# EAGLE design A203-V2-Expansion-Board (EAGLE 9.6.2)
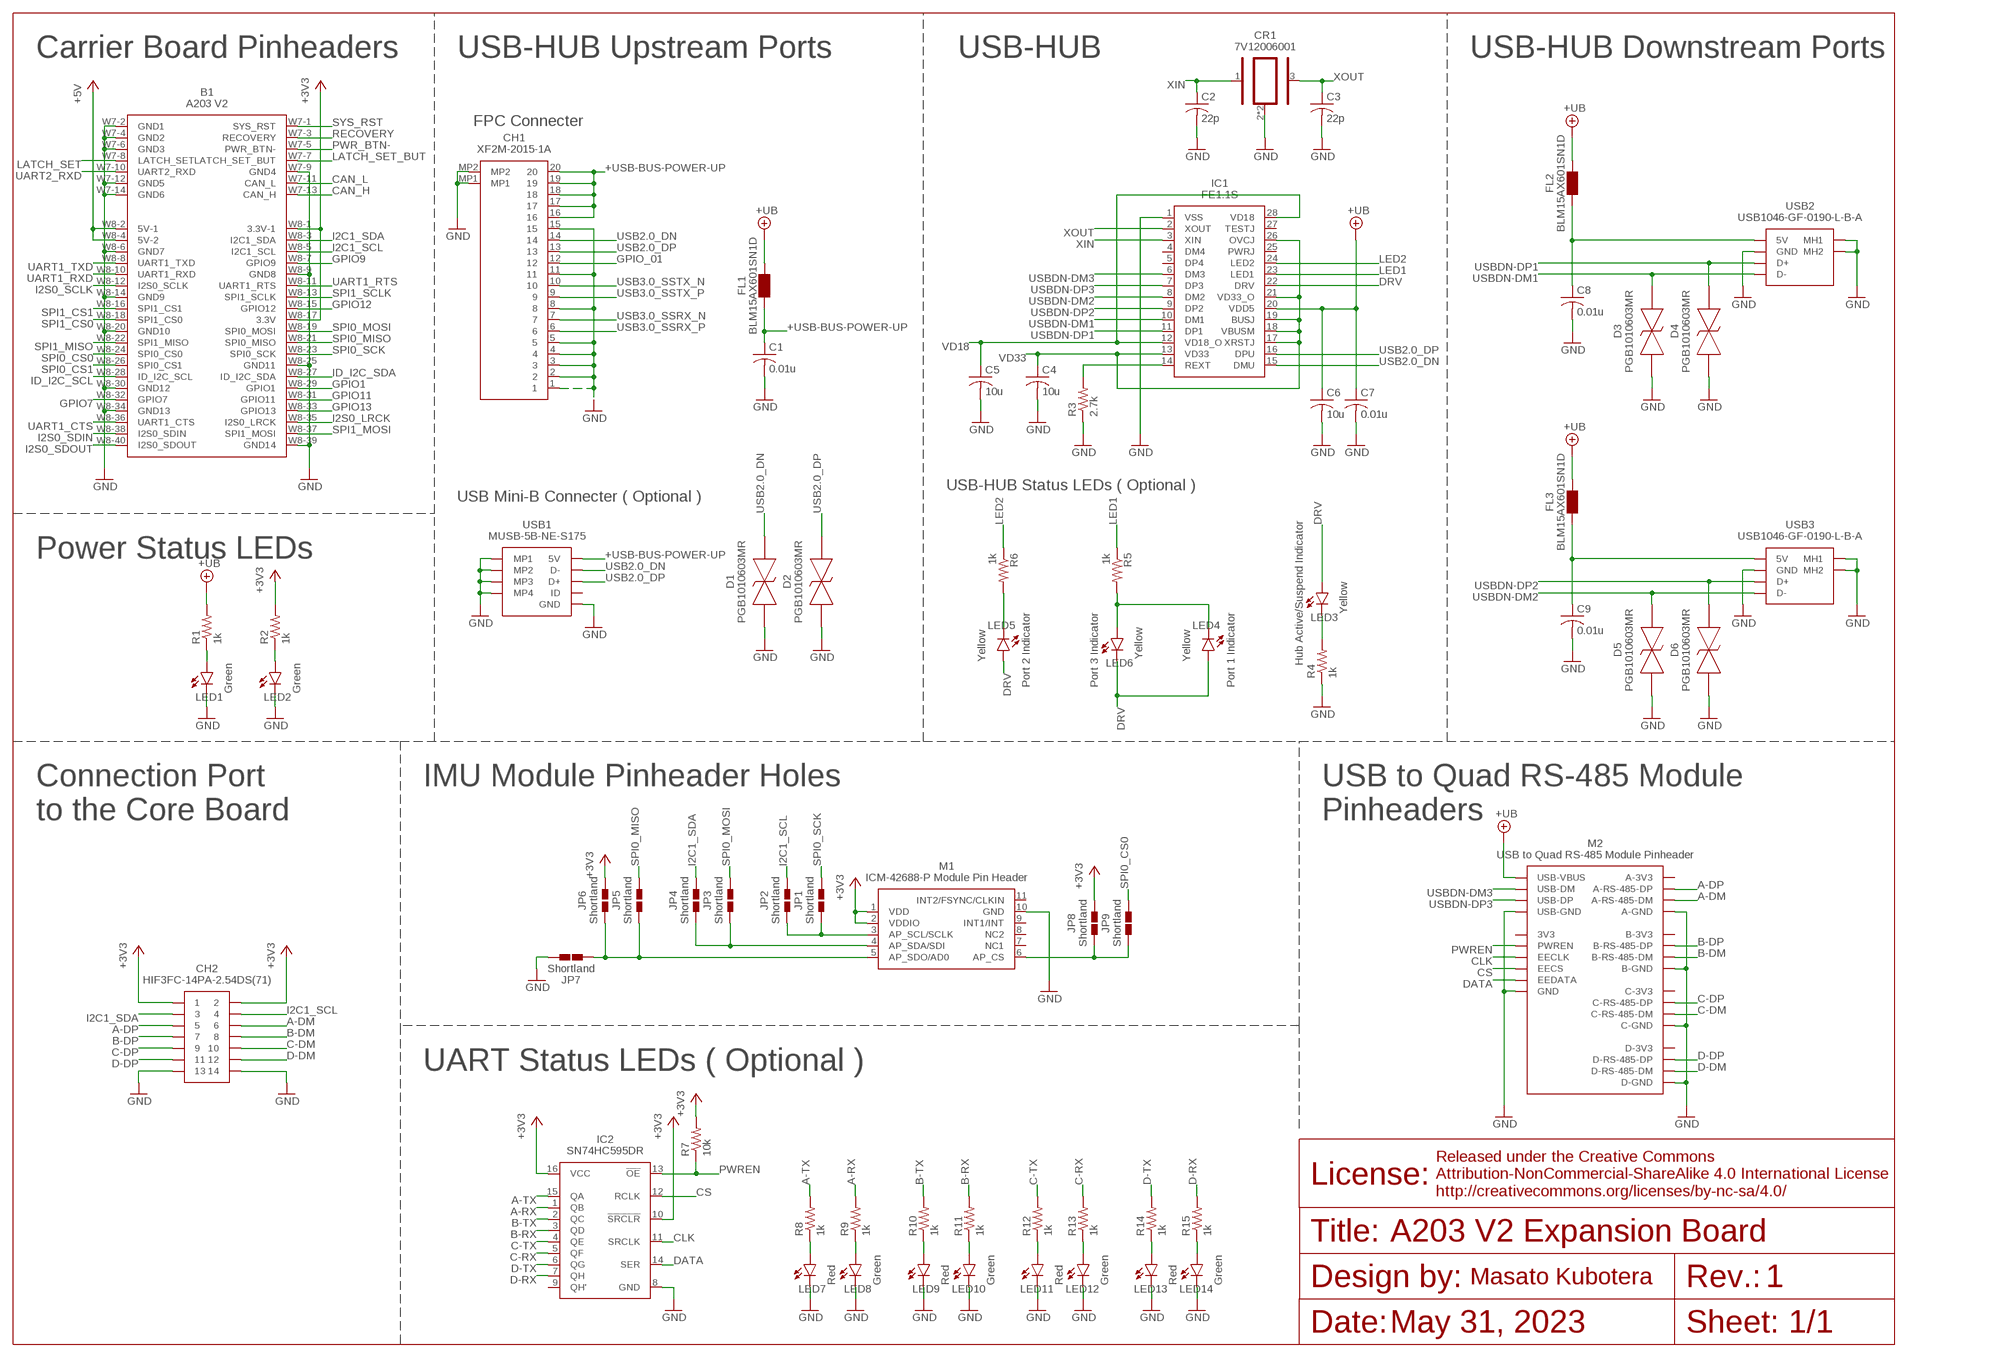
[diagram p0: schematic, sheet 1]

## Parts
B1  SEEED_A207_V2  [SEEED_A203_V2]
C1  0.01u  C-USC0603  [C0603]
C2  22p  C-USC0603  [C0603]
C3  22p  C-USC0603  [C0603]
C4  10u  C-USC0603  [C0603]
C5  10u  C-USC0603  [C0603]
C6  10u  C-USC0603  [C0603]
C7  0.01u  C-USC0603  [C0603]
C8  0.01u  C-USC0603  [C0603]
C9  0.01u  C-USC0603  [C0603]
CH1  XF2M-2015-1A  [XF2M-2015-1A]
CH2  HIF3FC-14PA-2.54DS(71)  [HIF3FC-14PA-2.54DS(71)]
CR1  7V12006001  [7V12006001]
D1  PGB1010603MR  [0603]
D2  PGB1010603MR  [0603]
D3  PGB1010603MR  [0603]
D4  PGB1010603MR  [0603]
D5  PGB1010603MR  [0603]
D6  PGB1010603MR  [0603]
FL1  BLM15AX601SN1D  [BLM15AX601SN1D]
FL2  BLM15AX601SN1D  [BLM15AX601SN1D]
FL3  BLM15AX601SN1D  [BLM15AX601SN1D]
IC1  FE1.1S  [FE1.1S]
IC2  SN74HC595DR  [SOIC-16]
JP1  SHORTLAND  [SHORTLAND]
JP2  SHORTLAND  [SHORTLAND]
JP3  SHORTLAND  [SHORTLAND]
JP4  SHORTLAND  [SHORTLAND]
JP5  SHORTLAND  [SHORTLAND]
JP6  SHORTLAND  [SHORTLAND]
JP7  SHORTLAND  [SHORTLAND]
JP8  SHORTLAND  [SHORTLAND]
JP9  SHORTLAND  [SHORTLAND]
LED1  Green  LEDSML0603  [SML0603]
LED2  Green  LEDSML0603  [SML0603]
LED3  Yellow  LEDSML0603  [SML0603]
LED4  Yellow  LEDSML0603  [SML0603]
LED5  Yellow  LEDSML0603  [SML0603]
LED6  Yellow  LEDSML0603  [SML0603]
LED7  Red  LEDSML0603  [SML0603]
LED8  Green  LEDSML0603  [SML0603]
LED9  Red  LEDSML0603  [SML0603]
LED10  Green  LEDSML0603  [SML0603]
LED11  Red  LEDSML0603  [SML0603]
LED12  Green  LEDSML0603  [SML0603]
LED13  Red  LEDSML0603  [SML0603]
LED14  Green  LEDSML0603  [SML0603]
M1  ICM-42688-P-MODULE-PINHEADER  [ICM-42688-P-MODULE-PINHEADER]
M2  USB-TO-QUAD-RS-485-CONV-MODULET-PLACE  [USB-TO-QUAD-RS-485-CONV-MODULE-SILK]
R1  1k  R-US_R0603  [R0603]
R2  1k  R-US_R0603  [R0603]
R3  2.7k  R-US_R0603  [R0603]
R4  1k  R-US_R0603  [R0603]
R5  1k  R-US_R0603  [R0603]
R6  1k  R-US_R0603  [R0603]
R7  10k  R-US_R0603  [R0603]
R8  1k  R-US_R0603  [R0603]
R9  1k  R-US_R0603  [R0603]
R10  1k  R-US_R0603  [R0603]
R11  1k  R-US_R0603  [R0603]
R12  1k  R-US_R0603  [R0603]
R13  1k  R-US_R0603  [R0603]
R14  1k  R-US_R0603  [R0603]
R15  1k  R-US_R0603  [R0603]
USB1  MINI_USB_B_SMD  [MINI_USB_B_SMD]
USB2  USB_A_X1_SMD  [USB_A_X1_SMD]
USB3  USB_A_X1_SMD  [USB_A_X1_SMD]

## Nets
+3V3 [low-power]: B1.W8-1(3.3V-1) B1.W8-17(3.3V) CH2.1 CH2.2 IC2.10(!SRCLR) IC2.16(VCC) JP6.2 JP8.2 M1.1(VDD) M1.2(VDDIO) R2.2 R7.2
+5V [low-power]: B1.W8-2(5V-1) B1.W8-4(5V-2)
+UB [usb-power]: C6.1 C7.1 FL1.2 FL2.2 FL3.2 IC1.20(VDD5) M2.USB-VBUS R1.2
+USB-BUS-POWER-UP [usb-power]: C1.1 CH1.16 CH1.17 CH1.18 CH1.19 CH1.20 FL1.1 USB1.1(5V)
+USB-BUS-POWER_DN1 [usb-power]: C8.1 FL2.1 USB2.1(5V)
+USB-BUS-POWER_DN2 [usb-power]: C9.1 FL3.1 USB3.1(5V)
A-DM: CH2.6 M2.A-RS-485-DM
A-DP: CH2.5 M2.A-RS-485-DP
A-RX: IC2.1(QB) R9.2
A-TX: IC2.15(QA) R8.2
AP_CS: JP8.1 JP9.1 M1.6(AP_CS)
AP_SCL/SCLK: JP1.1 JP2.1 M1.3(AP_SCL/SCLK)
AP_SDA/SDI: JP3.1 JP4.1 M1.4(AP_SDA/SDI)
AP_SDO/ADO: JP5.1 JP6.1 JP7.1 M1.5(AP_SDO/AD0)
B-DM: CH2.8 M2.B-RS-485-DM
B-DP: CH2.7 M2.B-RS-485-DP
B-RX: IC2.3(QD) R11.2
B-TX: IC2.2(QC) R10.2
C-DM: CH2.10 M2.C-RS-485-DM
C-DP: CH2.9 M2.C-RS-485-DP
C-RX: IC2.5(QF) R13.2
C-TX: IC2.4(QE) R12.2
CAN_H: B1.W7-13(CAN_H)
CAN_L: B1.W7-11(CAN_L)
CLK: IC2.11(SRCLK) M2.EECLK
CS: IC2.12(RCLK) M2.EECS
D-DM: CH2.12 M2.D-RS-485-DM
D-DP: CH2.11 M2.D-RS-485-DP
D-RX: IC2.7(QH) R15.2
D-TX: IC2.6(QG) R14.2
DATA: IC2.14(SER) M2.EEDATA
DRV: IC1.22(DRV) LED3.A LED4.A LED5.A LED6.C
GND: B1.W7-2(GND1) B1.W7-4(GND2) B1.W7-6(GND3) B1.W7-9(GND4) B1.W7-12(GND5) B1.W7-14(GND6) B1.W8-6(GND7) B1.W8-9(GND8) B1.W8-14(GND9) B1.W8-20(GND10) B1.W8-25(GND11) B1.W8-30(GND12) B1.W8-34(GND13) B1.W8-39(GND14) C1.2 C2.2 C3.2 C4.2 C5.2 C6.2 C7.2 C8.2 C9.2 CH1.1 CH1.2 CH1.3 CH1.4 CH1.5 CH1.8 CH1.11 CH1.15 CH1.MP1 CH1.MP2 CH2.13 CH2.14 CR1.2 CR1.4 D1.1 D2.1 D3.1 D4.1 D5.1 D6.1 IC1.1(VSS) IC2.8(GND) JP7.2 LED1.C LED2.C LED7.C LED8.C LED9.C LED10.C LED11.C LED12.C LED13.C LED14.C M1.10(GND) M2.A-GND M2.B-GND M2.C-GND M2.D-GND M2.GND1(GND) M2.USB-GND R3.1 R4.1 USB1.5(GND) USB1.MP1 USB1.MP2 USB1.MP3 USB1.MP4 USB2.4(GND) USB2.MH1 USB2.MH2 USB3.4(GND) USB3.MH1 USB3.MH2
GPIO1: B1.W8-29(GPIO1)
GPIO7: B1.W8-32(GPIO7)
GPIO9: B1.W8-7(GPIO9)
GPIO11: B1.W8-31(GPIO11)
GPIO12: B1.W8-15(GPIO12)
GPIO13: B1.W8-33(GPIO13)
GPIO_01: CH1.12
I2C1_SCL: B1.W8-5(I2C1_SCL) CH2.4 JP2.2
I2C1_SDA: B1.W8-3(I2C1_SDA) CH2.3 JP4.2
I2S0_LRCK: B1.W8-35(I2S0_LRCK)
I2S0_SCLK: B1.W8-12(I2S0_SCLK)
I2S0_SDIN: B1.W8-38(I2S0_SDIN)
I2S0_SDOUT: B1.W8-40(I2S0_SDOUT)
ID_I2C_SCL: B1.W8-28(ID_I2C_SCL)
ID_I2C_SDA: B1.W8-27(ID_I2C_SDA)
LATCH_SET: B1.W7-8(LATCH_SET)
LATCH_SET_BUT: B1.W7-7(LATCH_SET_BUT)
LED1 [low-power]: IC1.23(LED1) R5.1
LED2 [low-power]: IC1.24(LED2) R6.1
LED-3V3 [low-power]: LED2.A R2.1
LED-A-RX [low-power]: LED8.A R9.1
LED-A-TX [low-power]: LED7.A R8.1
LED-B-RX [low-power]: LED10.A R11.1
LED-B-TX [low-power]: LED9.A R10.1
LED-C-RX [low-power]: LED12.A R13.1
LED-C-TX [low-power]: LED11.A R12.1
LED-D-RX [low-power]: LED14.A R15.1
LED-D-TX [low-power]: LED13.A R14.1
LED-FE1.1S-DRV [low-power]: LED3.C R4.2
LED-FE1.1S-INDIVATOR1 [low-power]: LED4.C LED6.A R5.2
LED-FE1.1S-INDIVATOR2 [low-power]: LED5.C R6.2
LED-UB [low-power]: LED1.A R1.1
PWR_BTN-: B1.W7-5(PWR_BTN-)
PWREN: IC2.13(!OE) M2.PWREN R7.1
RECOVERY: B1.W7-3(RECOVERY)
REXT_FE1.1S: IC1.14(REXT) R3.2
SPI0_CS0: B1.W8-24(SPI0_CS0) JP9.2
SPI0_CS1: B1.W8-26(SPI0_CS1)
SPI0_MISO: B1.W8-21(SPI0_MISO) JP5.2
SPI0_MOSI: B1.W8-19(SPI0_MOSI) JP3.2
SPI0_SCK: B1.W8-23(SPI0_SCK) JP1.2
SPI1_CS0: B1.W8-18(SPI1_CS0)
SPI1_CS1: B1.W8-16(SPI1_CS1)
SPI1_MISO: B1.W8-22(SPI1_MISO)
SPI1_MOSI: B1.W8-37(SPI1_MOSI)
SPI1_SCLK: B1.W8-13(SPI1_SCLK)
SYS_RST: B1.W7-1(SYS_RST)
UART1_CTS: B1.W8-36(UART1_CTS)
UART1_RTS: B1.W8-11(UART1_RTS)
UART1_RXD: B1.W8-10(UART1_RXD)
UART1_TXD: B1.W8-8(UART1_TXD)
UART2_RXD: B1.W7-10(UART2_RXD)
USB2.0_DN: CH1.14 D1.2 IC1.15(DMU) USB1.2(D-)
USB2.0_DP: CH1.13 D2.2 IC1.16(DPU) USB1.3(D+)
USB3.0_SSRX_N: CH1.7
USB3.0_SSRX_P: CH1.6
USB3.0_SSTX_N: CH1.10
USB3.0_SSTX_P: CH1.9
USBDN-DM1: D3.2 IC1.10(DM1) USB2.2(D-)
USBDN-DM2: D5.2 IC1.8(DM2) USB3.2(D-)
USBDN-DM3: IC1.6(DM3) M2.USB-DM
USBDN-DP1: D4.2 IC1.11(DP1) USB2.3(D+)
USBDN-DP2: D6.2 IC1.9(DP2) USB3.3(D+)
USBDN-DP3: IC1.7(DP3) M2.USB-DP
VD18: C5.1 IC1.12(VD18_O) IC1.28(VD18)
VD33: C4.1 IC1.13(VD33) IC1.17(XRSTJ) IC1.18(VBUSM) IC1.19(BUSJ) IC1.21(VD33_O) IC1.26(OVCJ)
XIN: C2.1 CR1.1 IC1.3(XIN)
XOUT: C3.1 CR1.3 IC1.2(XOUT)
Unconnected: IC1.4(DM4) IC1.5(DP4) IC1.25(PWRJ) IC1.27(TESTJ) IC2.9(QH') M1.7(NC1) M1.8(NC2) M1.9(INT1/INT) M1.11(INT2/FSYNC/CLKIN) M2.3V3 M2.A-3V3 M2.B-3.3V(B-3V3) M2.C-3V3 M2.D-3V3 USB1.4(ID)

## Notes on the sheet
- Carrier Board Pinheaders | USB-HUB Upstream Ports | USB-HUB | USB-HUB Downstream Ports
- FPC Connecter
- USB-HUB Status LEDs ( Optional )
- USB Mini-B Connecter ( Optional )
- Power Status LEDs
- Hub Active/Suspend Indicator
- Port 2 Indicator | Port 3 Indicator | Port 1 Indicator
- Connection Port
  to the Core Board
- IMU Module Pinheader Holes
- USB to Quad RS-485 Module
  Pinheaders
- UART Status LEDs ( Optional )
- A203 V2 Expansion Board
- 1
- May 31, 2023 | 1/1

## Library data of the parts
B1 = Seeed_A203_V2:SEEED_A207_V2
C1-C9 = rcl:C-US: CAPACITOR, American symbol; SPICEPREFIX: C
CH1 = XF2M-2015-1A:XF2M-2015-1A
CH2 = HIF3FC:HIF3FC-14PA-2.54DS(71)
CR1 = 7V12006001:7V12006001
D1-D6 = PGB1010603MR:PGB1010603MR
FL1-FL3 = BLM15AX601SN1D:BLM15AX601SN1D
IC1 = FE1.1S:FE1.1S
IC2 = SN74HC595DR:SN74HC595DR
JP1-JP9 = Shortland:SHORTLAND
LED1-LED14 = led:LED: LED OSRAM: - CHIPLED LG R971, LG N971, LY N971, LG Q971, LY Q971, LO R971, LY R971 LH N974, LH R974 LS Q976, LO Q976, LY Q976 LO Q996 - Hyper CHIPLED LW Q18S LB Q993, LB Q99A, LB R99A - SideLED LS A670, LO A670, LY A670, LG A670, LP A670 LB A673, LV A673, LT A673, LW A673 LH A674 LY A675 LS A676, LA A676, LO A676, LY A676, LW A676 LS A679, LY A679, LG A679 - Hyper Micro SIDELED® LS Y876, LA Y876, LO Y876, LY Y876 LT Y87S - SmartLED LW L88C, LW L88S LB L89C, LB L89S, LG L890 LS L89K, LO L89K, LY L89K LS L896, LA L896, LO L896, LY L896 - TOPLED LS T670, LO T670, LY T670, LG T670, LP T670 LSG T670, LSP T670, LSY T670, LOP T670, LYG T670 LG T671, LOG T671, LSG T671 LB T673, LV T673, LT T673, LW T673 LH T674 LS T676, LA T676, LO T676, LY T676, LB T676, LH T676, LSB T676, LW T676 LB T67C, LV T67C, LT T67C, LS T67K, LO T67K, LY T67K, LW E67C LS E67B, LA E67B, LO E67B, LY E67B, LB E67C, LV E67C, LT E67C LW T67C LS T679, LY T679, LG T679 LS T770, LO T770, LY T770, LG T770, LP T770 LB T773, LV T773, LT T773, LW T773 LH T774 LS E675, LA E675, LY E675, LS T675 LS T776, LA T776, LO T776, LY T776, LB T776 LHGB T686 LT T68C, LB T68C - Hyper Mini TOPLED® LB M676 - Mini TOPLED Santana® LG M470 LS M47K, LO M47K, LY M47K Source: http://www.osram.convergy.de LUXEON: - LUMILED® LXK2-PW12-R00, LXK2-PW12-S00, LXK2-PW14-U00, LXK2-PW14-V00 LXK2-PM12-R00, LXK2-PM12-S00, LXK2-PM14-U00 LXK2-PE12-Q00, LXK2-PE12-R00, LXK2-PE12-S00, LXK2-PE14-T00, LXK2-PE14-U00 LXK2-PB12-K00, LXK2-PB12-L00, LXK2-PB12-M00, LXK2-PB14-N00, LXK2-PB14-P00, LXK2-PB14-Q00 LXK2-PR12-L00, LXK2-PR12-M00, LXK2-PR14-Q00, LXK2-PR14-R00 LXK2-PD12-Q00, LXK2-PD12-R00, LXK2-PD12-S00 LXK2-PH12-R00, LXK2-PH12-S00 LXK2-PL12-P00, LXK2-PL12-Q00, LXK2-PL12-R00 Source: www.luxeon.com KINGBRIGHT: KA-3528ASYC Source: www.kingbright.com
M1 = ICM-42688-P-Module:ICM-42688-P-MODULE-PINHEADER
M2 = USB-to-Quad-RS-485-Conv-Module:USB-TO-QUAD-RS-485-CONV-MODULE
R1-R15 = rcl:R-US_: RESISTOR, American symbol; SPICEPREFIX: R
USB1 = USB_Connector:MINI_USB_B_SMD
USB2 USB3 = USB_Connector:USB_A_X1_SMD

## Net classes
2 power: width 0.203 mm
4 usb-power: width 0.381 mm

## Board
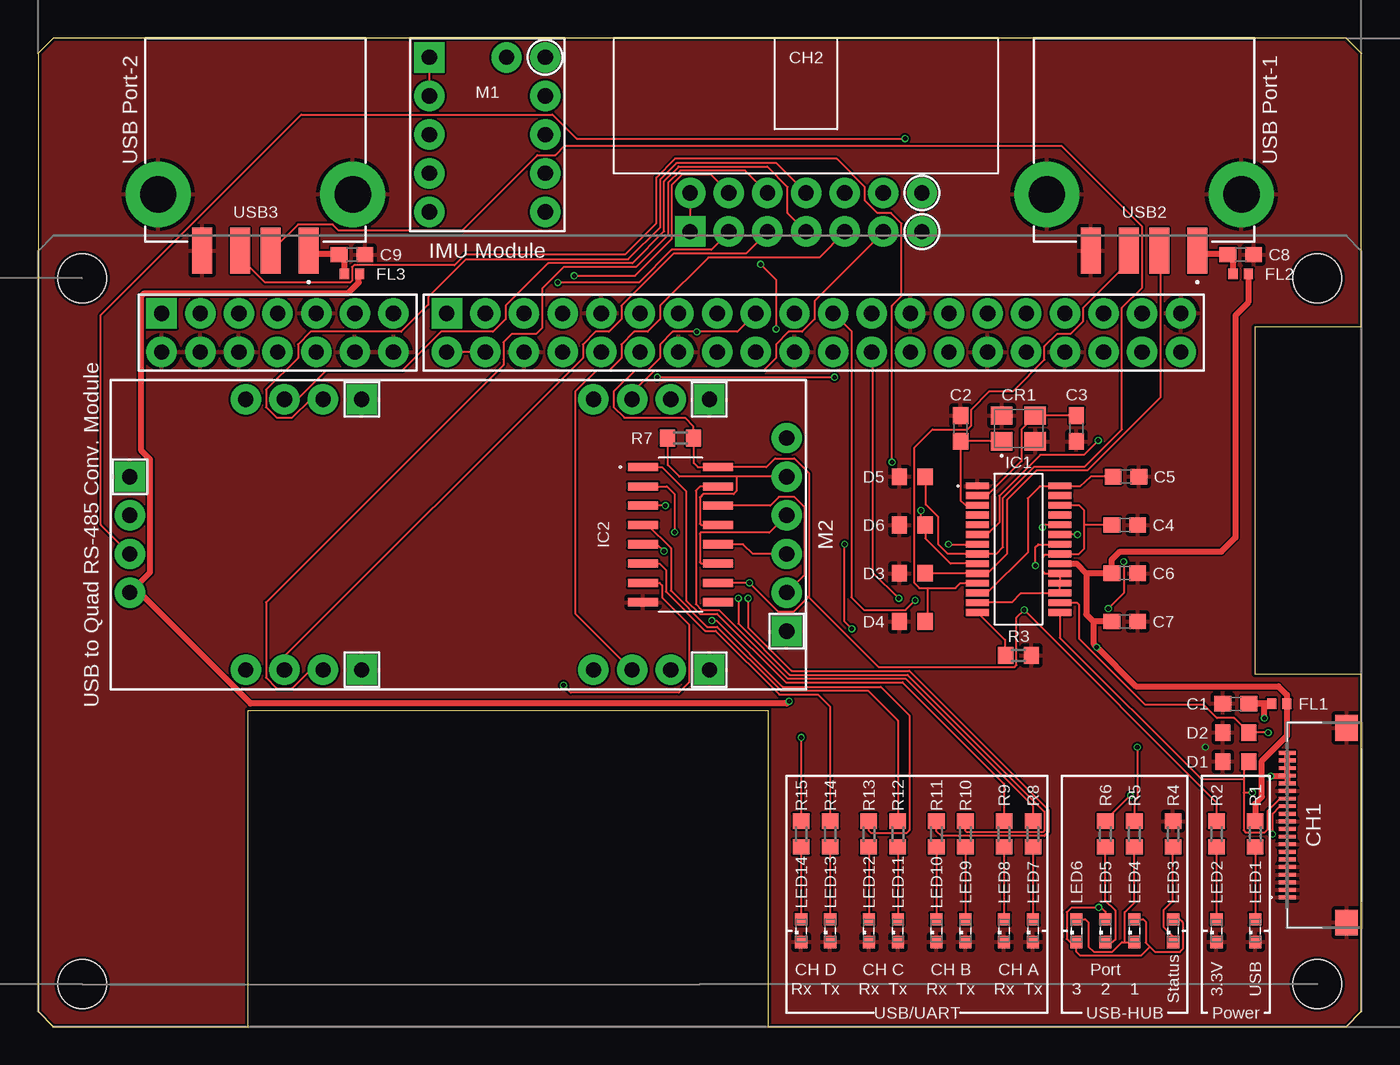
[diagram p1: board, top side]
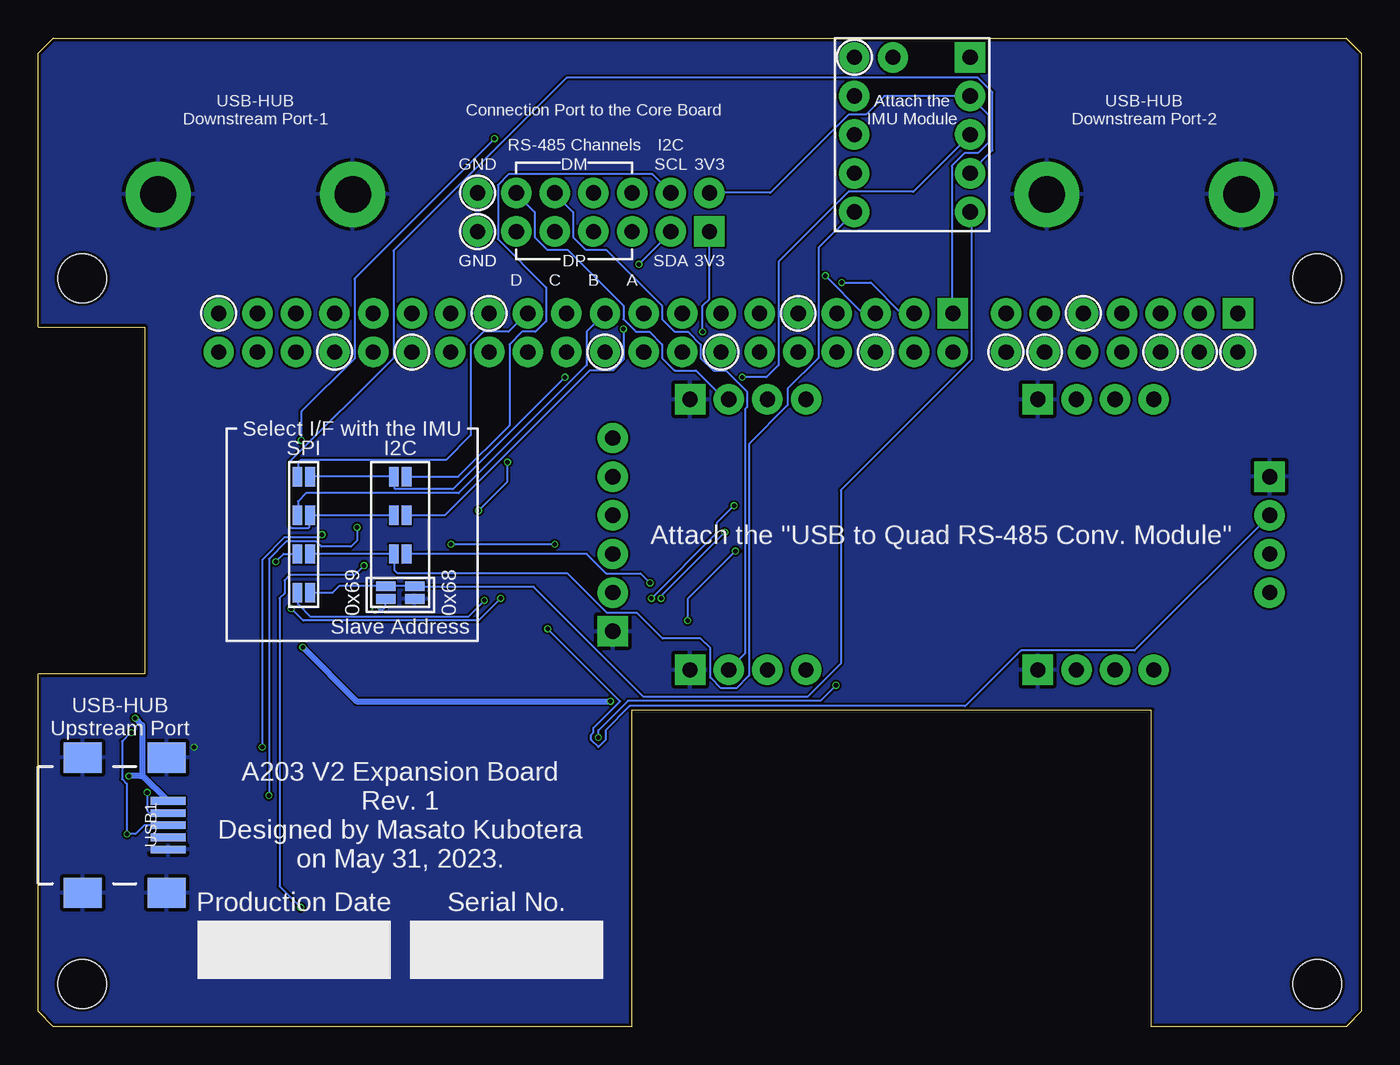
[diagram p2: board, bottom side, seen from below]

Size 87 x 65 mm. Coordinates in mm from the lower left corner, seen from the top.
Outline: 1,0 13.8,0 13.8,20.8 48,20.8 48,0 86,0 87,1 87,23.2 80,23.2 80,46 87,46 87,64 86,65 1,65 0,64 0,1 1,0
Copper layers (1*16): Top 0.035mm / dielectric 1.6mm / Bottom 0.035mm
Design rules "jlcpcb-2layers": minimum track width 5mil, minimum drill 0.3mm, track to track 5mil, track to pad 5mil, pad to pad 5mil, via to via 5mil, smd to smd 5mil, copper to edge 0.2mm, drill to drill 6mil, minimum pad ring 10mil, minimum via ring 3mil, stop-mask expansion 4mil, vias tented up to drill 0mil, thermal gap 10mil

### Footprints (pad centres in the part's own frame; a part is rotated, then mirrored left to right if it is on the bottom)
SEEED_A203_V2 = drill 1 pad 2 square: W7-1 -35.375,20.9; W8-1 -16.635,20.9 | drill 1 pad 2: W7-2 -35.375,18.36; W7-3 -32.835,20.9; W7-4 -32.835,18.36; W7-5 -30.295,20.9; W7-6 -30.295,18.36; W7-7 -27.755,20.9; W7-8 -27.755,18.36; W7-9 -25.215,20.9; W7-10 -25.215,18.36; W7-11 -22.675,20.9; W7-12 -22.675,18.36; W7-13 -20.135,20.9; W7-14 -20.135,18.36; W8-2 -16.635,18.36; W8-3 -14.095,20.9; W8-4 -14.095,18.36; W8-5 -11.555,20.9; W8-6 -11.555,18.36; W8-7 -9.015,20.9; W8-8 -9.015,18.36; W8-9 -6.475,20.9; W8-10 -6.475,18.36; W8-11 -3.935,20.9; W8-12 -3.935,18.36; W8-13 -1.395,20.9; W8-14 -1.395,18.36; W8-15 1.145,20.9; W8-16 1.145,18.36; W8-17 3.685,20.9; W8-18 3.685,18.36; W8-19 6.225,20.9; W8-20 6.225,18.36; W8-21 8.765,20.9; W8-22 8.765,18.36; W8-23 11.305,20.9; W8-24 11.305,18.36; W8-25 13.845,20.9; W8-26 13.845,18.36; W8-27 16.385,20.9; W8-28 16.385,18.36; W8-29 18.925,20.9; W8-30 18.925,18.36; W8-31 21.465,20.9; W8-32 21.465,18.36; W8-33 24.005,20.9; W8-34 24.005,18.36; W8-35 26.545,20.9; W8-36 26.545,18.36; W8-37 29.085,20.9; W8-38 29.085,18.36; W8-39 31.625,20.9; W8-40 31.625,18.36 | hole 3.2: -40.6,23.2; 40.6,23.2; -40.6,-23.2; 40.6,-23.2
C0603 = smd 1.1 x 1: 1 -0.85,0; 2 0.85,0
XF2M-2015-1A = smd 0.25 x 1.1: 1 -4.75,4.88; 2 -4.25,4.88; 3 -3.75,4.88; 4 -3.25,4.88; 5 -2.75,4.88; 6 -2.25,4.88; 7 -1.75,4.88; 8 -1.25,4.88; 9 -0.75,4.88; 10 -0.25,4.88; 11 0.25,4.88; 12 0.75,4.88; 13 1.25,4.88; 14 1.75,4.88; 15 2.25,4.88; 16 2.75,4.88; 17 3.25,4.88; 18 3.75,4.88; 19 4.25,4.88; 20 4.75,4.88 | smd 1.7 x 1.5: MP1 -6.4,0.98; MP2 6.4,0.98
HIF3FC-14PA-2.54DS(71) = drill 1 pad 2 square: 1 7.62,12.72 | drill 1 pad 2: 2 7.62,10.18; 3 5.08,12.72; 4 5.08,10.18; 5 2.54,12.72; 6 2.54,10.18; 7 0,12.72; 8 0,10.18; 9 -2.54,12.72; 10 -2.54,10.18; 11 -5.08,12.72; 12 -5.08,10.18; 13 -7.62,12.72; 14 -7.62,10.18
7V12006001 = smd 1.4 x 1.2: 1 -1.1,-0.85; 2 1.1,-0.85; 3 1.1,0.85; 4 -1.1,0.85
0603 = smd 1 x 1.1: 1 -0.85,0; 2 0.85,0
BLM15AX601SN1D = smd 0.6 x 0.7: 1 -0.5,0; 2 0.5,0
FE1.1S = smd 1.525 x 0.44: 1 -2.712,4.16; 2 -2.712,3.52; 3 -2.712,2.88; 4 -2.712,2.24; 5 -2.712,1.6; 6 -2.712,0.96; 7 -2.712,0.32; 8 -2.712,-0.32; 9 -2.712,-0.96; 10 -2.712,-1.6; 11 -2.712,-2.24; 12 -2.712,-2.88; 13 -2.712,-3.52; 14 -2.712,-4.16; 15 2.712,-4.16; 16 2.712,-3.52; 17 2.712,-2.88; 18 2.712,-2.24; 19 2.712,-1.6; 20 2.712,-0.96; 21 2.712,-0.32; 22 2.712,0.32; 23 2.712,0.96; 24 2.712,1.6; 25 2.712,2.24; 26 2.712,2.88; 27 2.712,3.52; 28 2.712,4.16
SOIC-16 = smd 1.981 x 0.533: 1 -2.464,4.445; 2 -2.464,3.175; 3 -2.464,1.905; 4 -2.464,0.635; 5 -2.464,-0.635; 6 -2.464,-1.905; 7 -2.464,-3.175; 8 -2.464,-4.445; 9 2.464,-4.445; 10 2.464,-3.175; 11 2.464,-1.905; 12 2.464,-0.635; 13 2.464,0.635; 14 2.464,1.905; 15 2.464,3.175; 16 2.464,4.445
SHORTLAND = smd 0.635 x 1.27: 1 -0.419,0; 2 0.419,0
SML0603 = smd 0.8 x 0.8: A 0.75,0; C -0.75,0
ICM-42688-P-MODULE-PINHEADER = drill 1 pad 2 square: 1 -3.81,5.08 | drill 1 pad 2: 2 -3.81,2.54; 3 -3.81,0; 4 -3.81,-2.54; 5 -3.81,-5.08; 6 3.81,-5.08; 7 3.81,-2.54; 8 3.81,0; 9 3.81,2.54; 10 3.81,5.08; 11 1.27,5.08
USB-TO-QUAD-RS-485-CONV-MODULE-SILK = drill 1 pad 2: 3V3 1.27,3.81; A-3V3 36.83,19.05; A-RS-485-DM 31.75,19.05; A-RS-485-DP 34.29,19.05; B-3.3V 36.83,1.27; B-RS-485-DM 31.75,1.27; B-RS-485-DP 34.29,1.27; C-3V3 13.97,19.05; C-RS-485-DM 8.89,19.05; C-RS-485-DP 11.43,19.05; D-3V3 13.97,1.27; D-RS-485-DM 8.89,1.27; D-RS-485-DP 11.43,1.27; EECLK 1.27,8.89; EECS 1.27,11.43; EEDATA 1.27,13.97; PWREN 1.27,6.35; USB-DM 44.45,11.43; USB-DP 44.45,8.89; USB-VBUS 44.45,13.97 | drill 1 pad 2 square: A-GND 29.21,19.05; B-GND 29.21,1.27; C-GND 6.35,19.05; D-GND 6.35,1.27; GND1 1.27,16.51; USB-GND 44.45,6.35
R0603 = smd 1 x 1.1: 1 -0.85,0; 2 0.85,0
MINI_USB_B_SMD = smd 0.5 x 2.3: 1 -1.6,8.55; 2 -0.8,8.55; 3 0,8.55; 4 0.8,8.55; 5 1.6,8.55 | smd 2 x 2.5: MP1 -4.45,8.45; MP2 4.45,8.45; MP3 4.45,2.95; MP4 -4.45,2.95
USB_A_X1_SMD = smd 1.3 x 3: 1 -3.5,13.98; 2 -1,13.98; 3 1,13.98; 4 3.5,13.98 | drill 2.38 pad 3.57: MH1 -6.4,10.28; MH2 6.4,10.28

### Placement (x,y rotation side)
B1  43.5,26 0 top
C1  78.74,21.24 180 top
C2  60.64,39.34 90 top
C3  68.27,39.34 270 top
C4  71.44,32.98 0 top
C5  71.52,36.16 0 top
C6  71.44,29.81 0 top
C7  71.44,26.64 0 top
C8  79.06,50.77 0 top
C9  20.64,50.77 0 top
CH1  87,13.25 90 top
CH2  50.48,65 180 top
CR1  64.45,39.34 0 top
D1  78.74,17.43 0 top
D2  78.74,19.33 0 top
D3  57.47,29.81 0 top
D4  57.47,26.64 0 top
D5  57.47,36.16 0 top
D6  57.47,32.98 0 top
FL1  81.6,21.24 0 top
FL2  79.06,49.5 0 top
FL3  20.64,49.5 0 top
IC1  64.45,31.4 0 top
IC2  42.23,32.35 0 top
JP1  69.53,36.16 180 bottom
JP2  63.19,36.16 0 bottom
JP3  69.53,33.62 180 bottom
JP4  63.19,33.62 0 bottom
JP5  69.53,28.54 180 bottom
JP6  64.14,28.54 270 bottom
JP7  62.23,28.54 270 bottom
JP8  63.19,31.08 0 bottom
JP9  69.53,31.08 180 bottom
LED1  80.01,6.32 90 top
LED2  77.47,6.32 90 top
LED3  74.61,6.32 90 top
LED4  72.08,6.32 90 top
LED5  70.17,6.32 90 top
LED6  68.27,6.32 90 top
LED7  65.41,6.32 90 top
LED8  63.5,6.32 90 top
LED9  60.96,6.32 90 top
LED10  59.06,6.32 90 top
LED11  56.52,6.32 90 top
LED12  54.61,6.32 90 top
LED13  52.07,6.32 90 top
LED14  50.17,6.32 90 top
M1  29.53,58.65 0 top
M2  50.48,42.51 180 top
R1  80.01,12.66 90 top
R2  77.47,12.66 90 top
R3  64.45,24.41 180 top
R4  74.61,12.66 270 top
R5  72.08,12.66 270 top
R6  70.17,12.66 270 top
R7  42.23,38.7 0 top
R8  65.41,12.66 90 top
R9  63.5,12.66 90 top
R10  60.96,12.66 90 top
R11  59.06,12.66 90 top
R12  56.52,12.66 90 top
R13  54.61,12.66 90 top
R14  52.07,12.66 90 top
R15  50.17,12.66 90 top
USB1  87,13.25 270 bottom
USB2  72.71,65 180 top
USB3  14.29,65 180 top

### Tracks (layer width: path | path; a pad name or v marks a point on that pad's centre or on a via)
+3V3  (via drill 0.3)
  Top 0.127: CH2.2 CH2.1 | M1.1 M1.2 | R2.2 77.47,14.76 v64.84,27.4 64.33,26.89 64.33,23.78 64.2,23.65 55.25,23.65 50.64,28.25 | IC2.10 v46.77,29.18 48.67,27.27 49.66,27.27 50.64,28.25 | B1.W8-17 45.98,45.69 v43.31,45.69 41.72,45.69 40.9,44.86 40.9,43.97 40.07,43.14 39.24,43.14 37.85,41.75 37.85,40.73 38.55,40.03 42.52,40.03 43.08,39.47 R7.2 43.12,38.7 43.12,37.05 43.37,36.8 IC2.16 47.88,36.8 48.45,37.37 49.72,37.37 50.68,36.41 50.68,28.29 50.64,28.25
  Bottom 0.127: B1.W8-1 26.93,46.95 26.93,56.61 26.1,57.43 25.21,57.43 24.51,58.13 24.51,59.97 M1.2 31.36,61.19 32.58,59.97 33.72,59.97 38.86,54.83 CH2.2 | v64.84,27.4 64.36,27.4 64.14,27.62 JP6.2 | JP8.2 50.93,31.08 49.66,29.81 47.41,29.81 v46.77,29.18 | CH2.1 42.87,47.84 43.31,47.4 v43.31,45.69
+5V
  Top 0.127: B1.W8-2 26.93,44.35 B1.W8-4
+UB  (via drill 0.3)
  Top 0.381: FL3.2 21.08,49.5 21.08,48.92 20.39,48.23 6.99,48.23 6.8,48.03 6.8,37.87 7.37,37.3 7.37,29.87 M2.USB-VBUS 6.48,28.73 13.97,21.24 49.22,21.24 v49.37,21.4 | R1.2 80.01,14.66 80.46,15.11 80.46,17.49 82.1,19.13 FL1.2 82.1,21.81 81.54,22.37 72.18,22.37 v69.6,24.95 69.38,25.17 69.38,26.64 | 70.61,29.81 C6.1 | 70.74,26.57 C7.1 69.38,26.64 | C6.1 68.9,29.81 | 68.9,29.81 68.28,30.44 IC1.20 | 68.9,29.81 68.9,27.11 69.38,26.64 | C6.1 70.59,30.71 71.12,31.24 77.79,31.24 78.71,32.16 78.71,46.77 79.56,47.61 FL2.2
  Bottom 0.381: v49.37,21.4 66.04,21.4 v69.6,24.95
+USB-BUS-POWER-UP  (via drill 0.3)
  Top 0.381: CH1.16 82.11,16.03 82.11,16.48 CH1.17 | CH1.17 82.11,16.66 82.11,16.98 CH1.18 82.11,17.17 82.11,17.49 CH1.19 82.11,17.68 82.11,18 CH1.20 | FL1.1 C1.1 80.62,21.24 v80.62,20.29 | v81.03,16.48 81.92,16.48 CH1.17
  Bottom 0.381: v80.62,20.29 80.14,19.81 80.14,16.54 | 80.14,16.54 78.49,14.89 USB1.1 | v81.03,16.48 80.27,16.48 80.14,16.54
+USB-BUS-POWER_DN1
  Top 0.381: FL2.1 78.55,50.45 78.23,50.77 C8.1 78.04,50.83 76.46,50.83 76.27,51.02 USB2.1
+USB-BUS-POWER_DN2
  Top 0.381: FL3.1 20.13,50.45 19.81,50.77 C9.1 19.62,50.83 18.04,50.83 17.85,51.02 USB3.1
A-DM
  Top 0.127: M2.A-RS-485-DM 17.91,23.46 16.7,22.25 15.69,22.25 14.99,22.95 14.99,27.91 30.59,43.51 30.59,43.86 30.59,43.87 30.59,45 31.14,45.55 32.76,45.55 33.14,45.93 33.14,48.53 34.55,49.94 39.33,49.94 41.42,52.03 41.42,55.48 42.23,56.29 46.48,56.29 CH2.6
A-DP
  Top 0.127: M2.A-RS-485-DP 16.2,24.35 35.82,43.97 35.82,44.86 36.64,45.69 37.53,45.69 38.36,46.51 38.36,47.4 41.79,50.83 46.55,50.83 47.95,52.23 CH2.5
A-RX
  Top 0.127: IC2.1 41.02,36.8 42.61,35.21 42.61,28.03 43.5,27.14 44.64,27.14 49.15,22.63 56.84,22.63 63.5,15.97 R9.2
A-TX
  Top 0.127: IC2.15 43.53,35.52 43.25,35.24 43.25,27.78 43.63,27.4 44.77,27.4 49.28,22.89 57.02,22.89 65.41,14.51 R8.2
AP_CS
  Bottom 0.127: JP9.1 JP8.1 63.57,31.08 63.57,30 63.38,29.81 52.2,29.81 49.6,27.21 47.63,27.21 45.95,25.52 43.44,25.52 42.8,24.89 42.8,22.95 42.1,22.25 41.09,22.25 40.26,23.08 40.26,38.32 37.72,40.86 37.72,41.94 35.69,43.97 35.69,51.21 M1.6
AP_SCL/SCLK  (via drill 0.3)
  Top 0.127: v40.71,42.7 v52.36,42.7
  Bottom 0.127: JP1.1 JP2.1 63.57,36.16 63.57,35.4 63.5,35.34 59.72,35.34 v52.36,42.7 | v40.71,42.7 39.12,42.7 38.33,43.49 38.33,50.29 33.72,54.89 29.47,54.89 M1.3
AP_SDA/SDI
  Bottom 0.127: JP4.1 JP3.1 69.15,33.62 69.15,32.86 69.22,32.8 70.36,32.8 70.49,32.92 70.49,37.11 63.63,43.97 63.63,51.02 52.26,62.39 25.21,62.39 24.26,61.43 24.26,57.62 25.72,56.16 M1.4
AP_SDO/ADO
  Bottom 0.127: JP5.1 67.63,28.54 67.21,28.96 JP6.1 JP7.1 62.23,28.92 54.42,28.92 47.18,21.68 36.42,21.68 34.23,23.87 34.23,35.27 25.66,43.84 25.66,53.5 M1.5
B-DM
  Top 0.127: M2.B-RS-485-DM 17.91,41.24 16.7,40.03 15.69,40.03 14.99,40.73 14.99,41.88 17.08,43.97 17.08,44.86 17.91,45.69 23.88,45.69 25.66,47.46 25.66,47.97 28.13,50.45 38.8,50.45 40.91,52.56 40.91,55.71 41.98,56.78 41.98,56.8 48.52,56.8 CH2.8
B-DP
  Top 0.127: M2.B-RS-485-DP 17.02,41.24 18.93,43.14 23.94,43.14 26.48,45.69 29.91,45.69 30.74,46.51 30.74,47.4 33.53,50.19 39.06,50.19 41.17,52.3 41.17,55.59 42.12,56.54 | 42.1,56.54 42.12,56.54 | 42.12,56.54 47.95,56.54 49.28,55.21 49.28,53.5 CH2.7
B-RX  (via drill 0.3)
  Top 0.127: v46.67,28.16 46.67,26.25 49.53,23.4 57.28,23.4 66.42,14.25 66.42,12.79 66.17,12.54 59.38,12.54 59.06,12.86 R11.2 | 39.66,34.26 IC2.3 v41.25,34.26
  Bottom 0.127: v41.25,34.26 42.39,33.11 42.39,32.45 v46.67,28.16
B-TX  (via drill 0.3)
  Top 0.127: v46.04,28.16 46.04,26.51 49.41,23.14 57.15,23.14 66.17,14.13 66.17,12.92 66.04,12.79 61.05,12.79 60.96,12.88 R10.2 | v41.85,32.51 41.85,35.02 41.34,35.52 IC2.2
  Bottom 0.127: v46.04,28.16 46.04,28.32 v41.85,32.51
C-DM
  Bottom 0.127: M2.C-RS-485-DM 40.52,24.54 40.52,40.61 40.39,40.73 40.39,41.75 41.79,43.14 42.61,43.14 43.44,43.97 43.44,44.86 44.26,45.69 45.15,45.69 45.98,46.51 45.98,47.4 49.66,51.08 50.99,51.08 51.82,51.91 51.82,53.56 53.02,54.77 CH2.10
C-DP
  Top 0.127: M2.C-RS-485-DP 39.02,23.46 35.31,27.18 35.31,41.75 36.7,43.14 37.53,43.14 38.36,43.97 38.36,44.86 39.18,45.69 40.07,45.69 40.9,46.51 40.9,47.4 44.07,50.58 51.37,50.58 53.02,52.23 CH2.9
C-RX  (via drill 0.3)
  Top 0.127: 44.39,26.7 v44.29,26.7 44.59,26.7 48.94,22.35 55.41,22.35 57.28,20.48 57.28,12.92 57.08,12.72 54.77,12.72 54.61,12.88 R13.2 | v41.15,31.27 40.71,31.71 IC2.5
  Bottom 0.127: v44.29,26.7 44.29,28.13 v41.15,31.27
C-TX
  Top 0.127: IC2.4 40.07,32.98 41.59,31.46 41.59,28.67 43.98,26.28 44.65,26.28 48.83,22.09 54.55,22.09 56.52,20.13 R12.2
CLK
  Top 0.127: IC2.11 43.59,30.45 43.5,30.54 43.5,32.41 43.56,32.48 48.07,32.48 M2.EECLK
CS
  Top 0.127: IC2.12 46.36,31.71 46.99,31.08 M2.EECS
D-DM
  Bottom 0.127: M2.D-RS-485-DM 41.85,41.24 43.75,43.14 45.15,43.14 45.98,43.97 45.98,44.86 46.8,45.69 47.69,45.69 48.52,46.51 48.52,47.4 52.2,51.08 53.53,51.08 54.36,51.91 54.36,53.56 55.56,54.77 CH2.12
D-DP
  Top 0.127: M2.D-RS-485-DP 39.05,41.68 40.52,43.14 47.69,43.14 48.52,43.97 48.52,44.86 49.34,45.69 50.23,45.69 51.06,46.51 51.06,47.72 55.56,52.23 CH2.11
D-RX  (via drill 0.3)
  Top 0.127: v50.17,19.02 R15.2 | v34.55,22.44 35.02,21.97 42.13,21.97 42.78,22.62 42.78,26.46 41.02,28.22 41.02,29.02 40.87,29.18 IC2.7
  Bottom 0.127: v50.17,19.02 50.17,19.49 48.23,21.43 35.56,21.43 v34.55,22.44
D-TX
  Top 0.127: IC2.6 40.87,30.45 41.28,30.03 41.28,28.6 43.85,26.03 44.54,26.03 48.73,21.84 51.28,21.84 52.07,21.05 R14.2
DATA
  Top 0.127: IC2.14 48.14,34.26 48.71,34.83 49.72,34.83 50.42,34.13 50.42,29.75 M2.EEDATA
DRV  (via drill 0.3)
  Top 0.127: LED4.A 72.66,7.07 72.82,6.9 72.82,5.52 73.08,5.26 | LED3.A 75.04,7.07 75.25,6.86 75.25,5.11 75.06,4.92 73.42,4.92 73.08,5.26 | LED5.A 70.17,7.55 69.88,7.84 v69.73,7.84 67.95,7.84 67.63,7.52 67.63,5.77 67.84,5.57 LED6.C 68.27,4.92 68.52,4.66 72.49,4.66 73.08,5.26 | v65.57,30.32 65.57,31.52 65.76,31.71 67.12,31.71 IC1.22
  Bottom 0.127: v65.57,30.32 66.2,29.68 70.46,29.68 70.8,29.34 70.8,28.49 71.12,28.17 71.12,9.24 v69.73,7.84
GND  (via drill 0.3)
  other vias: 76.74,18.38
  pour Top: -2.22,66.64 -2.22,-1.94 89.22,-1.94 89.22,66.64
  pour Bottom: -4.76,69.18 -4.76,-4.48 91.76,-4.48 91.76,69.18
I2C1_SCL  (via drill 0.3)
  Top 0.127: CH2.4 44.2,56.03 42.36,56.03 41.67,55.35 41.67,51.8 39.24,49.37 v35.24,49.37
  Bottom 0.127: JP2.2 59.38,36.16 56.01,39.52 56.01,44.86 55.18,45.69 54.3,45.69 53.6,46.38 53.6,48.61 56.77,51.78 56.77,55.34 56.07,56.03 46.61,56.03 CH2.4 | v35.24,49.37 32.83,46.95 32.01,46.95 B1.W8-5
I2C1_SDA  (via drill 0.3)
  Top 0.127: v48.52,45.88 48.52,49.11 v47.5,50.13 | v34.16,48.92 39.5,48.92 41.66,51.08 44.26,51.08 45.41,52.23 CH2.3
  Bottom 0.127: JP4.2 60.26,33.62 50.74,43.14 49.22,43.14 48.52,43.84 v48.52,45.88 | v47.5,50.13 45.41,52.23 CH2.3 | v34.16,48.92 32.26,48.92 30.29,46.95 29.47,46.95 B1.W8-3
LED1  (via drill 0.3)
  Top 0.127: R5.1 72.08,14.82 72.27,15.01 v72.27,18.38 | v68.33,32.35 67.19,32.35 IC1.23
  Bottom 0.127: v72.27,18.38 72.27,30.7 70.77,32.19 68.49,32.19 v68.33,32.35
LED2  (via drill 0.3)
  Top 0.127: v71.82,15.21 70.17,13.55 R6.1 | IC1.24 66.2,33 v66.03,32.83
  Bottom 0.127: v71.82,15.21 71.82,30.76 70.68,31.91 68.72,31.91 68.37,31.56 66.42,31.56 66.03,31.95 v66.03,32.83
LED-3V3
  Top 0.127: R2.1 LED2.A
LED-A-RX
  Top 0.127: R9.1 LED8.A
LED-A-TX
  Top 0.127: R8.1 LED7.A
LED-B-RX
  Top 0.127: R11.1 LED10.A
LED-B-TX
  Top 0.127: R10.1 LED9.A
LED-C-RX
  Top 0.127: R13.1 LED12.A
LED-C-TX
  Top 0.127: R12.1 LED11.A
LED-D-RX
  Top 0.127: R15.1 LED14.A
LED-D-TX
  Top 0.127: R14.1 LED13.A
LED-FE1.1S-DRV
  Top 0.127: LED3.C 74.61,5.93 73.98,6.57 73.98,7.65 74.61,8.28 R4.2
LED-FE1.1S-INDIVATOR1
  Top 0.127: 71.44,5.55 71.25,5.55 70.61,4.92 69.41,4.92 69.06,5.27 69.06,6.86 68.85,7.07 LED6.A | 71.44,5.55 72.08,5.55 LED4.C | R5.2 72.08,8.16 71.44,7.52 71.44,5.55
LED-FE1.1S-INDIVATOR2
  Top 0.127: LED5.C 70.64,5.57 70.81,5.73 70.81,7.65 70.17,8.28 R6.2
LED-UB
  Top 0.127: R1.1 LED1.A
PWREN
  Top 0.127: M2.PWREN 45.91,36.16 | 45.91,36.16 42.17,36.16 41.41,36.92 41.41,38.7 R7.1 | IC2.13 43.59,32.98 43.5,33.08 43.5,34.8 43.72,35.02 45.72,35.02 45.91,35.21 45.91,36.16
REXT_FE1.1S
  Top 0.127: R3.2 63.57,24.41 63.57,25.43 61.79,27.21 IC1.14
SPI0_CS0  (via drill 0.3)
  Top 0.127: v71.38,30.57 71.38,28.51 v70.36,27.49 | v56.58,28.16 54.87,29.87 54.87,44.35 B1.W8-24
  Bottom 0.127: v71.38,30.57 70.87,31.08 JP9.2 | v70.36,27.49 69.57,26.7 58.04,26.7 v56.58,28.16
SPI0_MISO  (via drill 0.3)
  Top 0.127: v57.66,28.03 57.02,27.4 54.3,27.4 53.47,28.22 53.47,45.75 52.33,46.89 B1.W8-21
  Bottom 0.127: v57.66,28.03 58.74,26.95 69.09,26.95 69.92,27.78 69.92,28.54 JP5.2
SPI0_MOSI
  Bottom 0.127: JP3.2 69.92,33.62 69.92,34.54 69.38,35.08 59.34,35.08 50.93,43.49 50.93,45.7 B1.W8-19
SPI0_SCK
  Bottom 0.127: JP1.2 69.92,36.16 69.92,37.08 69.73,37.27 60.17,37.27 58.55,38.89 58.55,44.86 57.72,45.69 56.07,45.69 54.87,46.89 B1.W8-23
USB2.0_DN  (via drill 0.3)
  Top 0.127: 79.25,16.32 79.25,17.11 79.57,17.43 D1.2 | 79.25,16.32 79.25,15.4 | 79.25,15.4 79.25,12.92 79.38,12.79 80.65,12.79 80.84,12.98 80.84,14.19 81.6,14.95 82.11,14.95 CH1.14 | IC1.15 67.17,25.57 76.46,16.28 79.22,16.28 79.25,16.32 | 79.25,15.4 v79.82,15.4
  Bottom 0.127: v79.82,15.4 79.82,14.19 79.69,14.06 78.49,14.06 USB1.2
USB2.0_DP  (via drill 0.3)
  Top 0.127: v81.16,12.66 81.16,14 81.6,14.44 82.11,14.44 CH1.13 | 67.82,27.84 67.19,27.84 IC1.16 68.29,27.88 68.42,27.75 68.42,25.52 72.77,21.17 76.62,21.17 77.5,20.29 78.64,20.29 D2.2 v80.87,19.33
  Bottom 0.127: USB1.3 78.49,13.24 80.01,13.24 80.58,12.66 v81.16,12.66 81.16,15.97 81.47,16.28 81.47,18.76 80.9,19.33 v80.87,19.33
USBDN-DM1
  Top 0.127: D3.2 61.72,29.81 IC1.10 61.79,29.81 62.42,29.81 63.69,31.08 63.69,34.64 65.63,36.57 69,36.57 73.79,41.37 73.79,50.96 73.73,51.02 USB2.2
USBDN-DM2
  Top 0.127: D5.2 58.36,36.16 58.36,34.32 59.18,33.49 59.18,31.71 59.82,31.08 61.72,31.08 IC1.8 61.79,31.08 62.99,31.08 63.44,31.52 63.44,34.76 65.5,36.83 68.81,36.83 71.25,39.27 71.25,47.27 72.58,48.61 72.58,52.61 67.28,57.91 34.61,57.91 34.01,57.3 32.83,57.3 27.88,52.35 19.75,52.35 19.37,52.73 17.08,52.73 15.43,51.08 15.31,51.08 USB3.2
USBDN-DM3  (via drill 0.3)
  Top 0.127: v69.69,38.54 68.74,37.59 65.88,37.59 63.19,34.89 63.19,33.14 62.55,32.51 61.76,32.51 IC1.6 | v56.99,58.38 35.4,58.38 33.82,59.97 17.31,59.97 4.13,46.8 4.13,32.98 M2.USB-DM
  Bottom 0.127: v69.69,38.54 69.69,40.45 66.2,43.94 66.2,49.18 v56.99,58.38
USBDN-DP1
  Top 0.127: 58.64,26.95 D4.2 58.48,26.79 58.48,28.84 | IC1.11 60.63,29.16 60.31,28.84 58.48,28.84 | 58.48,28.84 57.93,28.84 57.6,29.18 57.6,38.06 58.8,39.27 61.09,39.27 61.34,39.52 61.34,40.57 62.55,41.78 64.11,41.78 66.17,43.84 66.17,44.73 67,45.56 67.88,45.56 68.71,46.38 68.71,47.27 71.69,50.26 71.69,51.02 USB2.3
USBDN-DP2  (via drill 0.3)
  Top 0.127: IC1.9 61.72,30.45 59.98,30.45 58.32,32.1 D6.2 58.3,32.98 58.04,33.24 v58.04,33.94 | 41.87,57.05 52.52,57.05 54.36,55.21 54.36,54.32 55.18,53.5 56.07,53.5 56.77,52.8 56.77,48.03 56.14,47.4 v56.14,37.11 | 41.87,57.05 41.85,57.05 | USB3.3 13.34,51.02 13.34,50.51 14.93,48.92 20.51,48.92 20.64,49.05 20.64,49.94 20.77,50.07 27.37,50.07 28.07,50.77 38.58,50.77 40.64,52.83 40.64,55.82 41.87,57.05
  Bottom 0.127: v56.14,37.11 56.14,35.84 v58.04,33.94
USBDN-DP3  (via drill 0.3)
  Top 0.127: v59.85,31.71 61.6,31.71 IC1.7 | v53.02,31.71 53.02,26.64 v53.5,26.16
  Bottom 0.127: v53.02,31.71 v59.85,31.71 | v53.5,26.16 48.74,21.4 50.48,19.65 50.48,19.33 50.64,19.17 50.64,18.86 50.17,18.38 49.69,18.86 49.69,19.49 48.1,21.08 26.04,21.08 22.39,24.73 14.93,24.73 M2.USB-DP
VD18
  Top 0.127: C5.1 69.2,36.16 68.49,35.52 67.19,35.52 IC1.28 67.12,35.52 65.85,35.52 65.06,34.73 65.06,31.18 62.42,28.54 61.79,28.54 IC1.12
VD33
  Top 0.127: IC1.13 61.79,27.91 64.01,27.91 64.58,28.48 67.12,28.48 IC1.17 67.19,28.54 67.19,29.11 IC1.18 67.19,29.18 67.19,29.75 IC1.19 67.12,29.81 66.17,29.81 66.01,29.97 66.01,30.86 66.17,31.02 67.12,31.02 IC1.21 | 67.19,31.08 IC1.21 | 68.77,32.98 68.77,33.94 68.46,34.26 67.19,34.26 IC1.26 | C4.1 68.77,32.98 | IC1.21 68.41,31.08 68.77,31.44 68.77,32.98
XIN
  Top 0.127: CR1.1 63.31,38.51 60.64,38.51 C2.1 60.64,34.6 60.93,34.32 61.72,34.32 IC1.3
XOUT
  Top 0.127: C3.1 68.27,40.22 65.6,40.22 CR1.3 65.53,40.16 64.64,39.27 64.64,37.18 62.42,34.95 61.79,34.95 IC1.2

### Text on the board
tPlace: USB Port-2 | USB Port-1 | IMU Module | USB to Quad RS-485 Conv. Module | CH D | CH C | CH B | CH A | Port | Rx | Tx | Rx | Tx | Rx | Tx | Rx | Tx | 3 | 2 | 1 | Status | 3.3V | USB | USB/UART | USB-HUB | Power
bPlace: USB-HUB / Downstream Port-2 | Attach the / IMU Module | Connection Port to the Core Board | USB-HUB / Downstream Port-1 | I2C | RS-485 Channels | 3V3 | SCL | DM | GND | 3V3 | SDA | DP | GND | GND | A | B | C | D | Select I/F with the IMU | I2C | SPI | Attach the "USB to Quad RS-485 Conv. Module" | 0x68 | 0x69 | Slave Address | USB-HUB / Upstream Port | A203 V2 Expansion Board / Rev. 1 / Designed by Masato Kubotera / on May 31, 2023. | Serial No. | Production Date